# EAGLE schematic v0a (EAGLE 9.3.0)
CREVISION: v0a; DESIGNER: Rafael Silva

## Sheet 1 of 4: Main Controller
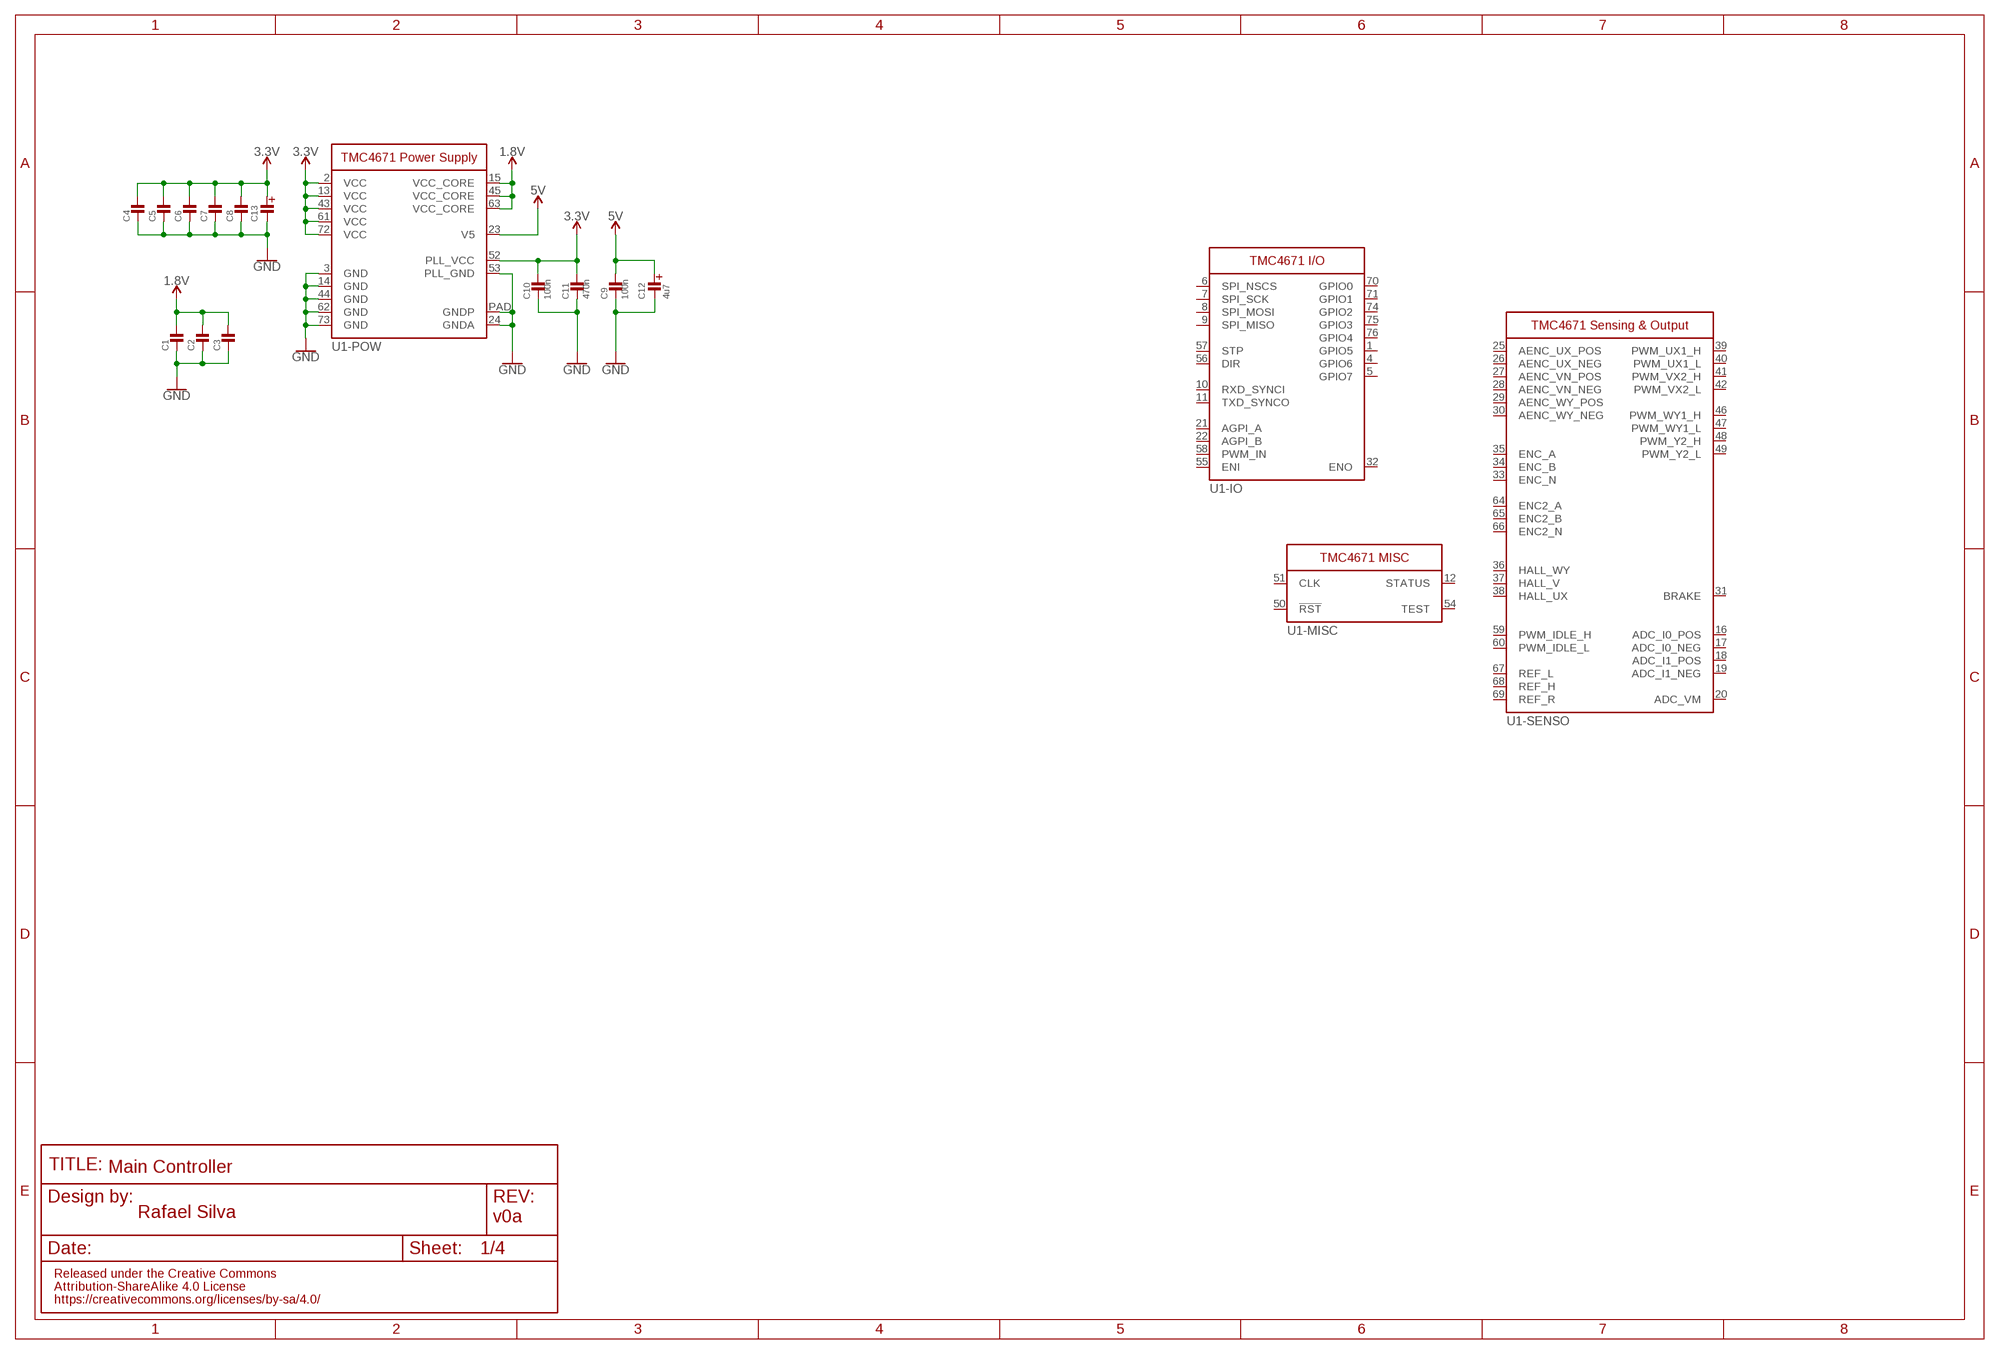
[diagram p0: schematic, sheet 1]

### Parts
C1  MLCC0603  [0603_WAVE]
C2  MLCC0603  [0603_WAVE]
C3  MLCC0603  [0603_WAVE]
C4  MLCC0603  [0603_WAVE]
C5  MLCC0603  [0603_WAVE]
C6  MLCC0603  [0603_WAVE]
C7  MLCC0603  [0603_WAVE]
C8  MLCC0603  [0603_WAVE]
C9  100n  MLCC0603  [0603_WAVE]
C10  100n  MLCC0603  [0603_WAVE]
C11  470n  MLCC0603  [0603_WAVE]
C12  4u7  CAPACITOR_TAN3216  [EIA3216]
C13  CAPACITOR_TAN3216  [EIA3216]
U1  TMC4671  [QFN76]

### Nets
1.8V: C1.P$1 C2.P$1 C3.P$1 U1.15(-POW:VCC_CORE) U1.45(-POW:VCC_CORE) U1.63(-POW:VCC_CORE)
3.3V: U1.2(-POW:VCC) U1.13(-POW:VCC) U1.43(-POW:VCC) U1.61(-POW:VCC) U1.72(-POW:VCC) ; also sheet 2
5V: C9.P$1 C12.+(AN) U1.23(-POW:V5) ; also sheet 2
GND: C1.P$2 C2.P$2 C3.P$2 C4.P$2 C5.P$2 C6.P$2 C7.P$2 C8.P$2 C9.P$2 C10.P$2 C11.P$2 C12.-(CA) C13.-(CA) U1.3(-POW:GND) U1.14(-POW:GND) U1.24(-POW:GNDA) U1.44(-POW:GND) U1.53(-POW:PLL_GND) U1.62(-POW:GND) U1.73(-POW:GND) U1.PAD(-POW:GNDP) ; also sheet 2
N$1: C4.P$1 C5.P$1 C6.P$1 C7.P$1 C8.P$1 C13.+(AN) ; supply symbol labelled 3.3V
N$2: C10.P$1 C11.P$1 U1.52(-POW:PLL_VCC) ; supply symbol labelled 3.3V
Unconnected: U1.1(-IO:GPIO5) U1.4(-IO:GPIO6) U1.5(-IO:GPIO7) U1.6(-IO:SPI_NSCS) U1.7(-IO:SPI_SCK) U1.8(-IO:SPI_MOSI) U1.9(-IO:SPI_MISO) U1.10(-IO:RXD_SYNCI) U1.11(-IO:TXD_SYNCO) U1.12(-MISC:STATUS) U1.16(-SENSO:ADC_I0_POS) U1.17(-SENSO:ADC_I0_NEG) U1.18(-SENSO:ADC_I1_POS) U1.19(-SENSO:ADC_I1_NEG) U1.20(-SENSO:ADC_VM) U1.21(-IO:AGPI_A) U1.22(-IO:AGPI_B) U1.25(-SENSO:AENC_UX_POS) U1.26(-SENSO:AENC_UX_NEG) U1.27(-SENSO:AENC_VN_POS) U1.28(-SENSO:AENC_VN_NEG) U1.29(-SENSO:AENC_WY_POS) U1.30(-SENSO:AENC_WY_NEG) U1.31(-SENSO:BRAKE) U1.32(-IO:ENO) U1.33(-SENSO:ENC_N) U1.34(-SENSO:ENC_B) U1.35(-SENSO:ENC_A) U1.36(-SENSO:HALL_WY) U1.37(-SENSO:HALL_V) U1.38(-SENSO:HALL_UX) U1.39(-SENSO:PWM_UX1_H) U1.40(-SENSO:PWM_UX1_L) U1.41(-SENSO:PWM_VX2_H) U1.42(-SENSO:PWM_VX2_L) U1.46(-SENSO:PWM_WY1_H) U1.47(-SENSO:PWM_WY1_L) U1.48(-SENSO:PWM_Y2_H) U1.49(-SENSO:PWM_Y2_L) U1.50(-MISC:!RST!) U1.51(-MISC:CLK) U1.54(-MISC:TEST) U1.55(-IO:ENI) U1.56(-IO:DIR) U1.57(-IO:STP) U1.58(-IO:PWM_IN) U1.59(-SENSO:PWM_IDLE_H) U1.60(-SENSO:PWM_IDLE_L) U1.64(-SENSO:ENC2_A) U1.65(-SENSO:ENC2_B) U1.66(-SENSO:ENC2_N) U1.67(-SENSO:REF_L) U1.68(-SENSO:REF_H) U1.69(-SENSO:REF_R) U1.70(-IO:GPIO0) U1.71(-IO:GPIO1) U1.74(-IO:GPIO2) U1.75(-IO:GPIO3) U1.76(-IO:GPIO4)

### Notes on the sheet
- Main Controller

## Sheet 2 of 4: Power Management
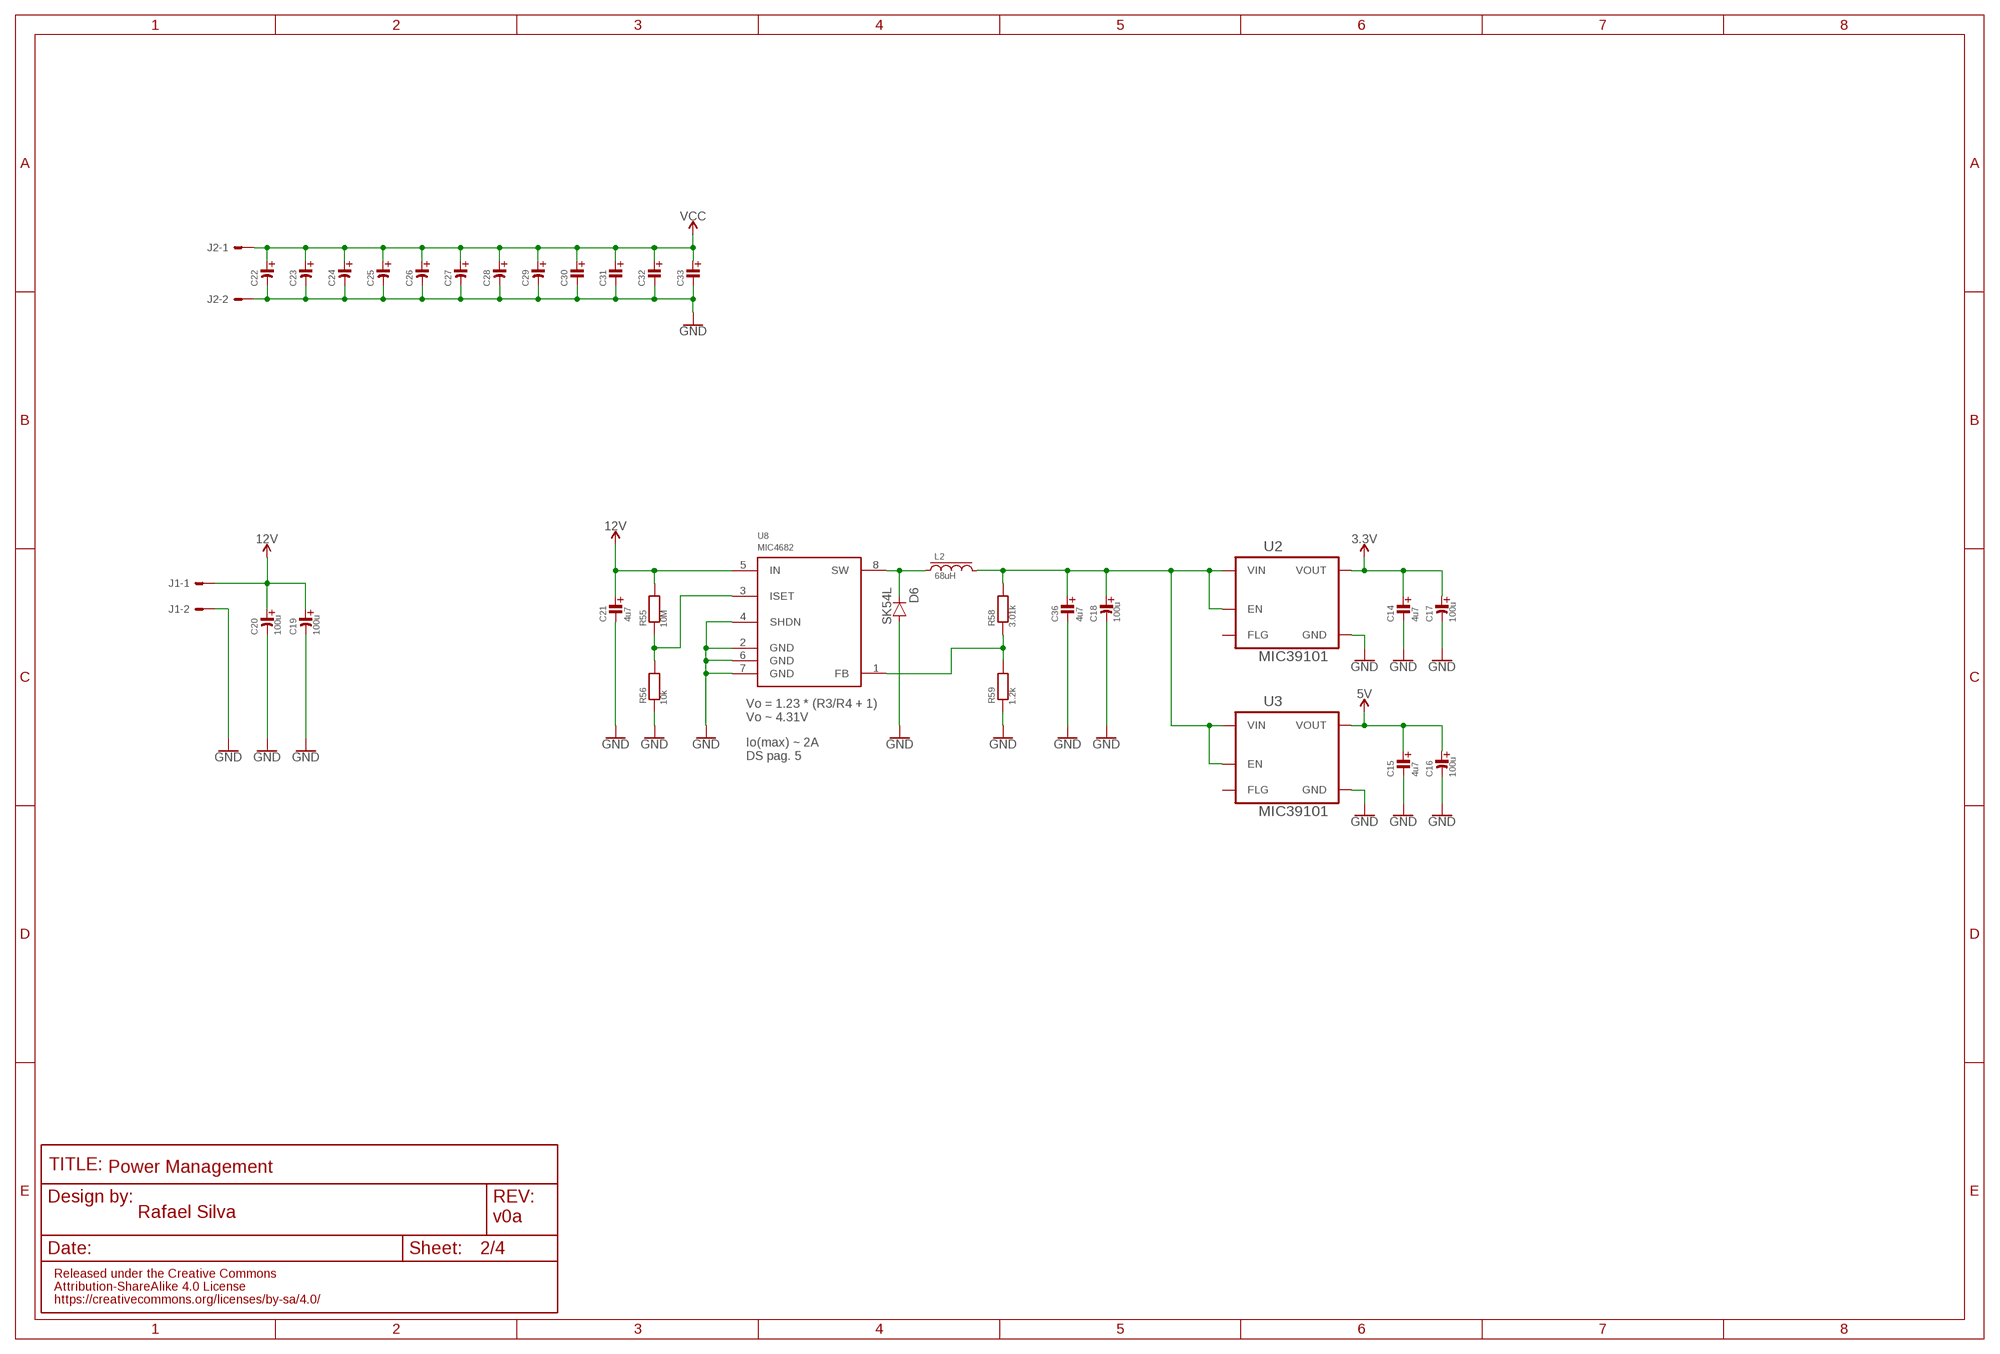
[diagram p1: schematic, sheet 2]

### Parts
C14  4u7  CAPACITOR_TAN3216  [EIA3216]
C15  4u7  CAPACITOR_TAN3216  [EIA3216]
C16  100u  CAPACITOR_EL10X10  [10X10-EL]
C17  100u  CAPACITOR_EL10X10  [10X10-EL]
C18  100u  CAPACITOR_EL10X10  [10X10-EL]
C19  100u  CAPACITOR_EL10X10  [10X10-EL]
C20  100u  CAPACITOR_EL10X10  [10X10-EL]
C21  4u7  CAPACITOR_TAN3216  [EIA3216]
C22  CAPACITOR_EL10X10  [10X10-EL]
C23  CAPACITOR_EL10X10  [10X10-EL]
C24  CAPACITOR_EL10X10  [10X10-EL]
C25  CAPACITOR_EL10X10  [10X10-EL]
C26  CAPACITOR_EL10X10  [10X10-EL]
C27  CAPACITOR_EL10X10  [10X10-EL]
C28  CAPACITOR_EL10X10  [10X10-EL]
C29  CAPACITOR_EL10X10  [10X10-EL]
C30  CAPACITOR_TAN3216  [EIA3216]
C31  CAPACITOR_TAN3216  [EIA3216]
C32  CAPACITOR_TAN3216  [EIA3216]
C33  CAPACITOR_TAN3216  [EIA3216]
C36  4u7  CAPACITOR_TAN3216  [EIA3216]
D6  SK54L  [DO214AA]
J1  2EDG-2P  [2EDG-2P]
J2  2EDG-2P  [2EDG-2P]
L2  68uH  INDUCTOR1207  [1207]
R55  10M  RESISTOR0603  [0603_WAVE]
R56  10k  RESISTOR0603  [0603_WAVE]
R58  3.01k  RESISTOR0603  [0603_WAVE]
R59  1.2k  RESISTOR0603  [0603_WAVE]
U2  MIC39101  [SOIC8]
U3  MIC39101  [SOIC8]
U8  MIC4682  [SOIC8]

### Nets
3.3V: C14.+(AN) C17.AN U2.3(VOUT) ; also sheet 1
5V: C15.+(AN) C16.AN U3.3(VOUT) ; also sheet 1
12V: C19.AN C20.AN C21.+(AN) J1.P$1 R55.P$2 U8.5(IN)
GND: C14.-(CA) C15.-(CA) C16.CAT(CA) C17.CAT(CA) C18.CAT(CA) C19.CAT(CA) C20.CAT(CA) C21.-(CA) C22.CAT(CA) C23.CAT(CA) C24.CAT(CA) C25.CAT(CA) C26.CAT(CA) C27.CAT(CA) C28.CAT(CA) C29.CAT(CA) C30.-(CA) C31.-(CA) C32.-(CA) C33.-(CA) C36.-(CA) D6.A J1.P$2 J2.P$2 R56.P$1 R59.P$1 U2.5(GND) U2.6(GND) U2.7(GND) U2.8(GND) U3.5(GND) U3.6(GND) U3.7(GND) U3.8(GND) U8.2(GND) U8.4(SHDN) U8.6(GND) U8.7(GND) ; also sheet 1
N$3: C18.AN C36.+(AN) L2.2 R58.P$2 U2.1(EN) U2.2(VIN) U3.1(EN) U3.2(VIN)
N$45: D6.C L2.1 U8.8(SW)
N$46: R58.P$1 R59.P$2 U8.1(FB)
N$47: R55.P$1 R56.P$2 U8.3(ISET)
VCC: C22.AN C23.AN C24.AN C25.AN C26.AN C27.AN C28.AN C29.AN C30.+(AN) C31.+(AN) C32.+(AN) C33.+(AN) J2.P$1
Unconnected: U2.4(FLG) U3.4(FLG)

### Notes on the sheet
- Vo = 1.23 * (R3/R4 + 1)
  Vo ~ 4.31V
- Io(max) ~ 2A
  DS pag. 5
- Power Management

## Sheet 3 of 4: Power Stage
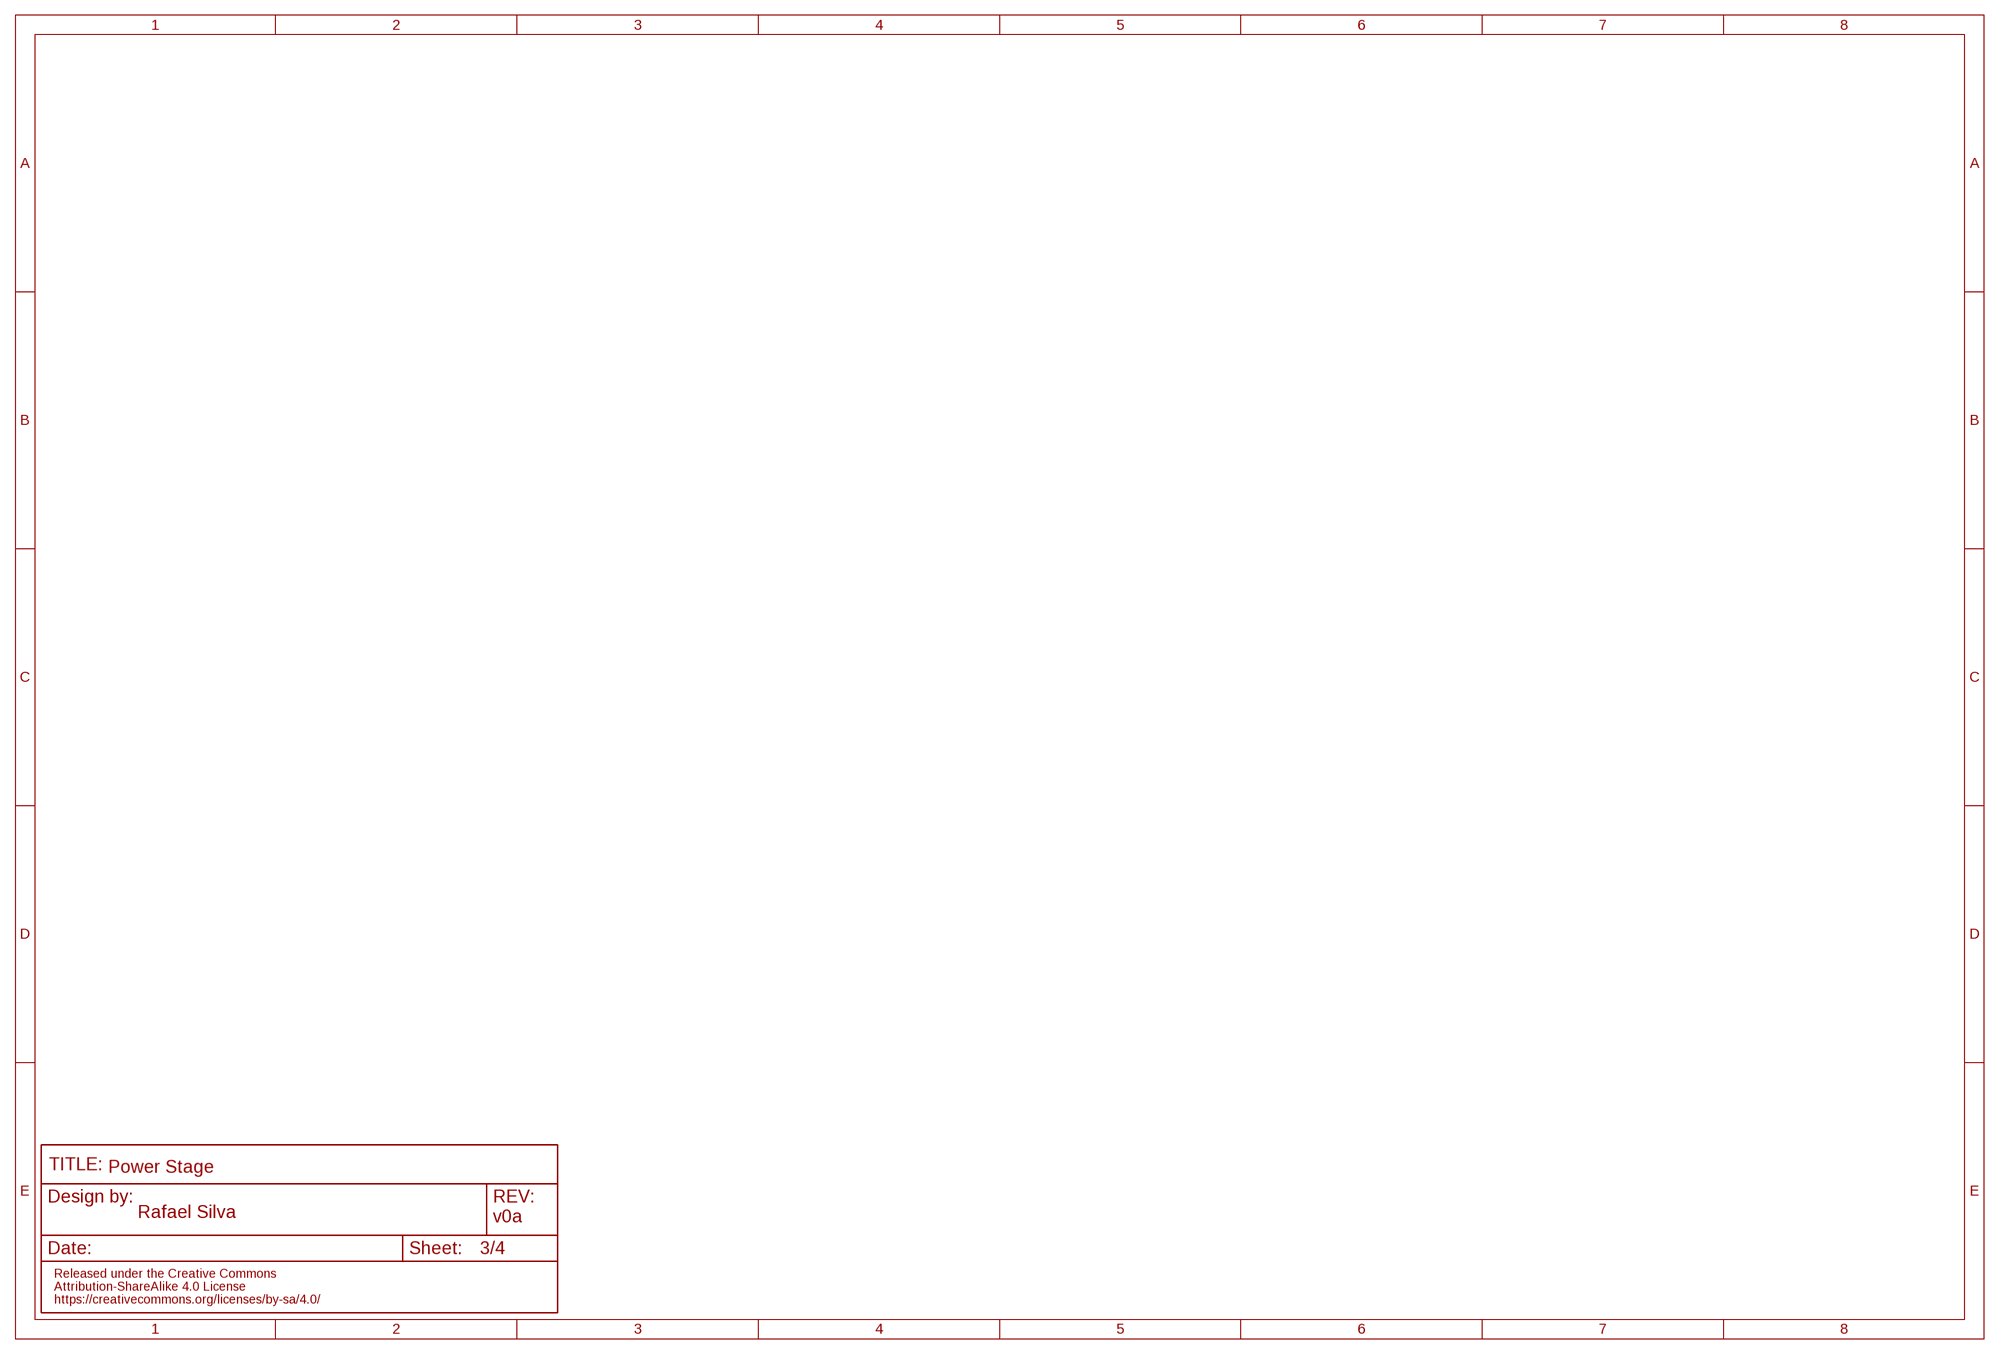
[diagram p2: schematic, sheet 3]

### Notes on the sheet
- Power Stage

## Sheet 4 of 4: Interface
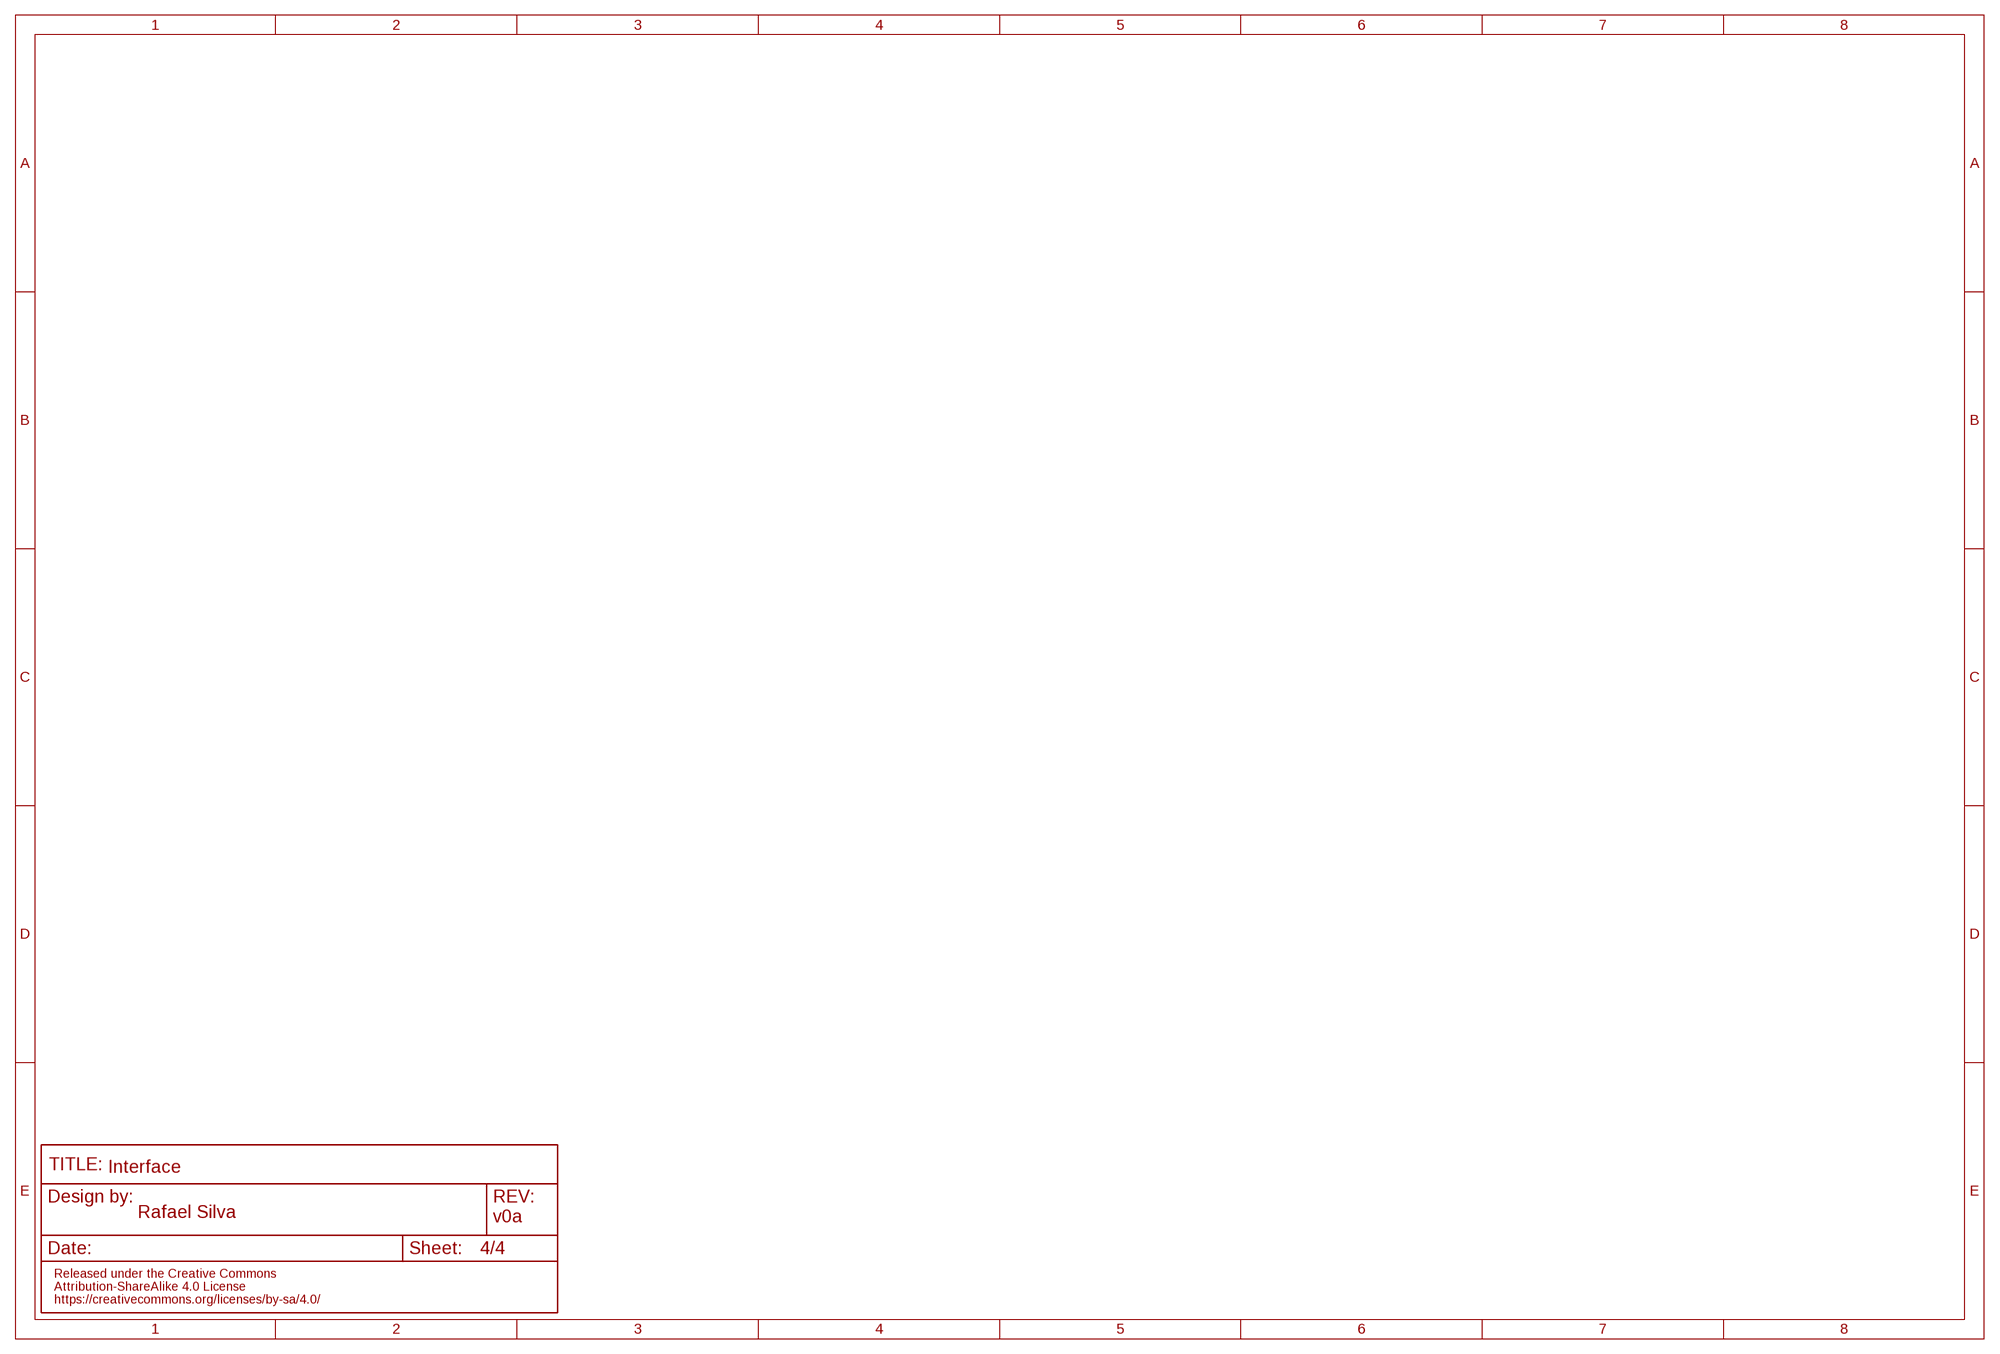
[diagram p3: schematic, sheet 4]

### Notes on the sheet
- Interface

## Library data of the parts
C1-C11 = Passive Components > Capacitors > Multilayer Ceramic Capacitors MLCC:MLCC: KEMET’s X7R dielectric features a 125°C maximum operating temperature and is considered temperature stable. The Electronics Components, Assemblies and Materials Association (EIA) characterizes X7R dielectric as a Class II material. Components of this classification are fixed, ceramic dielectric capacitors suited for bypass and decoupling applications or for frequency discriminating circuits where Q and stability of capacitance characteristics are not critical. X7R exhibits a predictable change in capacitance with respect to time and voltage, boasting a minimal change in capacitance with reference to ambient temperature. Capacitance change is limited to ±15% from −55°C to +125°C.
C12-C15 C21 C30-C33 C36 = Passive Components > Capacitors > Tantalum Capacitors:CAPACITOR_TAN: The KEMET T490, designed for customer product applications (low temperature demanding applications), meets RoHS compliance with leads constructed of 100% matte tin and green molding compound. The T490 is classified as MSL (Moisture Sensitivity Level) 1 under J STD 020: unlimited floor life time at ≤ 30°C/85% RH.
C16-C20 C22-C29 = Passive Components > Capacitors > Aluminium Electrolytic Capacitors:CAPACITOR_EL
D6 = Semiconductors > Discrete Semiconductors > Diodes & Rectifiers > Schottky Diodes & Rectifiers:SK54L
J1 J2 = Connectors > Other:2EDG-2P
L2 = Passive Components > Inductors, Chokes & Coils:INDUCTOR
R55 R56 R58 R59 = Passive Components > Resistors > Chip Resistors:RESISTOR: Resistors For new designs, use the packages preceded by an '_' character since they are more reliable: The following footprints should be used on most boards: _0402 - Standard footprint for regular board layouts _0603 - Standard footprint for regular board layouts _0805 - Standard footprint for regular board layouts _1206 - Standard footprint for regular board layouts For extremely tight-pitch boards where space is at a premium, the following 'micro-pitch' footprints can be used (smaller pads, no silkscreen outline, etc.): _0402MP - Micro-pitch footprint for very dense/compact boards _0603MP - Micro-pitch footprint for very dense/compact boards _0805MP - Micro-pitch footprint for very dense/compact boards _1206MP - Micro-pitch footprint for very dense/compact boards
U1 = Semiconductors > Embedded Processors & Controllers > Motor Controller:TMC4671: The TMC4671 is a fully integrated servo controller, providing Field Oriented Control for BLDC/PMSM and 2-phase Stepper Motors as well as DC motors and voice coils. All control functions are implemented in hardware. Integrated ADCs, position sensor interfaces, position interpolators, enable a fully functional servo controller for a wide range of servo applications.
U2 U3 = Power > LDO Voltage Regulators:MIC39101: IC, LDO VOLT REG, 3.3V, 0.3A,
U8 = Power > Switching Controllers:MIC4682